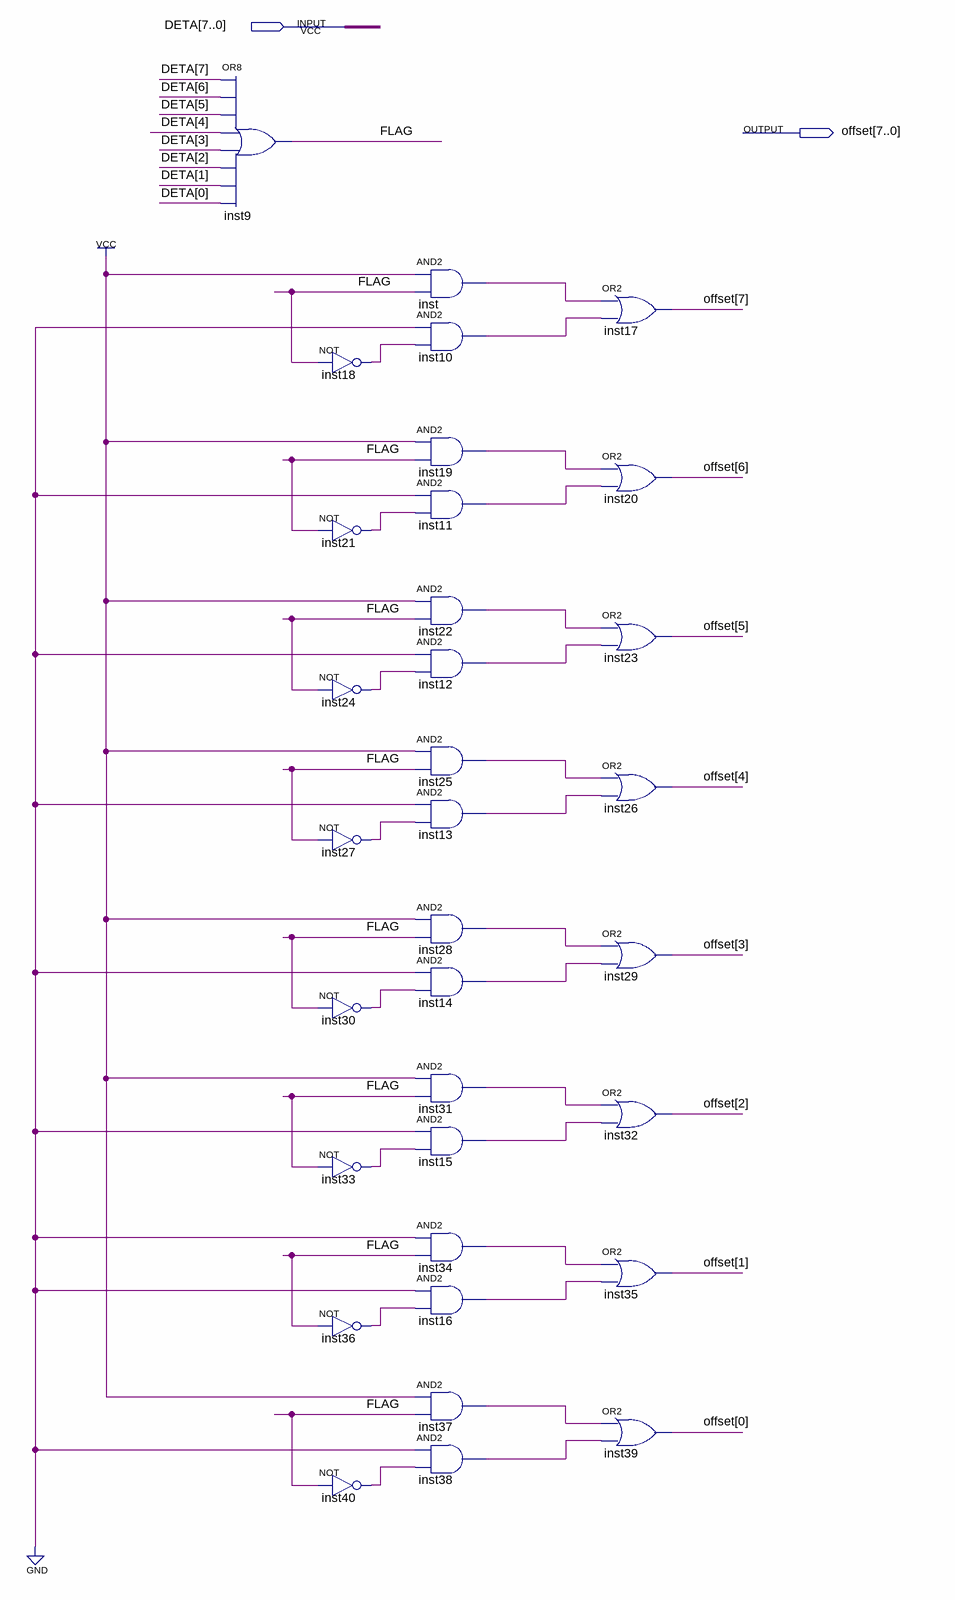
[diagram p0: schematic sheet]
// Quartus schematic sss.bdf as structural Verilog: 33 symbols, 2 pins
module sss (
  input  [7:0] DETA,
  output [7:0] offset
);

  wire FLAG, inst10_out, inst11_out, inst12_out, inst13_out, inst14_out, inst15_out, inst16_out, inst18_out,
       inst19_out, inst21_out, inst22_out, inst24_out, inst25_out, inst27_out, inst28_out, inst30_out,
       inst31_out, inst33_out, inst34_out, inst36_out, inst37_out, inst38_out, inst40_out, inst_out;

  or inst9 (FLAG, DETA[7], DETA[6], DETA[5], DETA[4], DETA[3], DETA[2], DETA[1], DETA[0]);
  not inst18 (inst18_out, FLAG);
  not inst21 (inst21_out, FLAG);
  not inst24 (inst24_out, FLAG);
  not inst27 (inst27_out, FLAG);
  not inst30 (inst30_out, FLAG);
  not inst33 (inst33_out, FLAG);
  not inst36 (inst36_out, FLAG);
  not inst40 (inst40_out, FLAG);
  and inst (inst_out, 1'b1, FLAG);
  and inst10 (inst10_out, 1'b0, inst18_out);
  and inst19 (inst19_out, 1'b1, FLAG);
  and inst11 (inst11_out, 1'b0, inst21_out);
  and inst22 (inst22_out, 1'b1, FLAG);
  and inst12 (inst12_out, 1'b0, inst24_out);
  and inst25 (inst25_out, 1'b1, FLAG);
  and inst13 (inst13_out, 1'b0, inst27_out);
  and inst28 (inst28_out, 1'b1, FLAG);
  and inst14 (inst14_out, 1'b0, inst30_out);
  and inst31 (inst31_out, 1'b1, FLAG);
  and inst15 (inst15_out, 1'b0, inst33_out);
  and inst34 (inst34_out, 1'b0, FLAG);
  and inst16 (inst16_out, 1'b0, inst36_out);
  and inst37 (inst37_out, 1'b1, FLAG);
  and inst38 (inst38_out, 1'b0, inst40_out);
  or inst17 (offset[7], inst_out, inst10_out);
  or inst20 (offset[6], inst19_out, inst11_out);
  or inst23 (offset[5], inst22_out, inst12_out);
  or inst26 (offset[4], inst25_out, inst13_out);
  or inst29 (offset[3], inst28_out, inst14_out);
  or inst32 (offset[2], inst31_out, inst15_out);
  or inst35 (offset[1], inst34_out, inst16_out);
  or inst39 (offset[0], inst37_out, inst38_out);
endmodule
